# EAGLE schematic DESIGN7MP_Schematic (EAGLE 9.3.2)
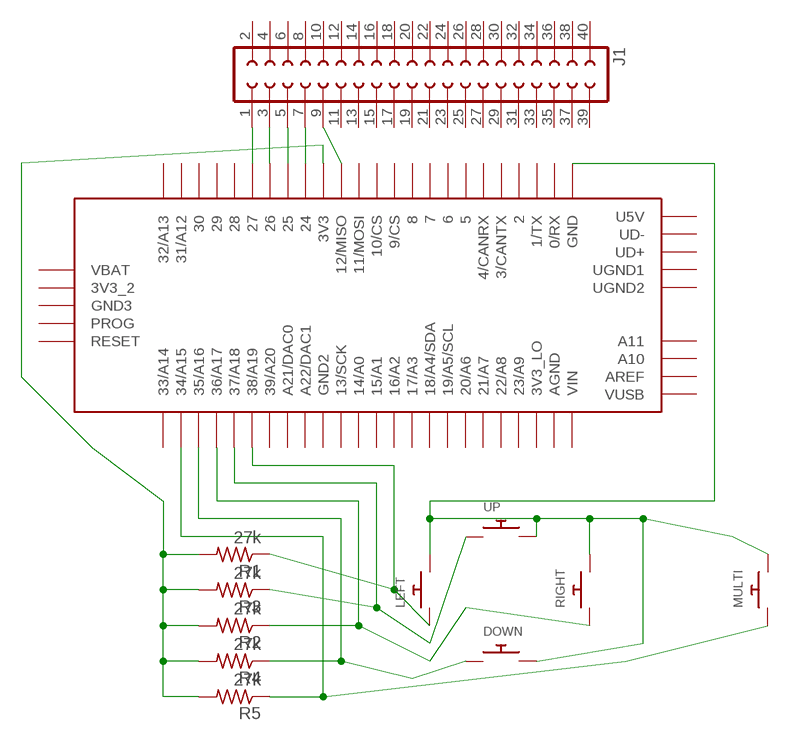
[diagram p0: schematic, sheet 1]

## Parts
DOWN  SWITCH_PUSHBUTTONEVQ-PE  [TACT_PANA-EVQ]
J1  SOCKET-40V  [S40V]
LEFT  SWITCH_PUSHBUTTONEVQ-PE  [TACT_PANA-EVQ]
MULTI  SWITCH_PUSHBUTTONEVQ-PE  [TACT_PANA-EVQ]
R1  27k  R-US_0204/5  [0204/5]
R2  27k  R-US_0204/5  [0204/5]
R3  27k  R-US_0204/5  [0204/5]
R4  27k  R-US_0204/5  [0204/5]
R5  27k  R-US_0204/5  [0204/5]
RIGHT  SWITCH_PUSHBUTTONEVQ-PE  [TACT_PANA-EVQ]
U$1  TEENSY_3.5/3.6  [TEENSY_3.5/3.6]
UP  SWITCH_PUSHBUTTONEVQ-PE  [TACT_PANA-EVQ]

## Nets
N$1: R1.2 R2.2 R3.2 R4.2 R5.2 U$1.3V3
N$2: MULTI.P$1 R5.1 U$1.34/A15
N$3: DOWN.P$1 R4.1 U$1.35/A16
N$4: R2.1 RIGHT.P$1 U$1.36/A17
N$5: R3.1 U$1.37/A18 UP.P$1
N$6: LEFT.P$1 R1.1 U$1.38/A19
N$7: DOWN.P$2 LEFT.P$2 MULTI.P$2 RIGHT.P$2 U$1.GND UP.P$2
N$8: J1.9 U$1.12/MISO
N$9: J1.7 U$1.24
N$10: J1.5 U$1.25
N$11: J1.3 U$1.26
N$12: J1.1 U$1.27
Unconnected: J1.2 J1.4 J1.6 J1.8 J1.10 J1.11 J1.12 J1.13 J1.14 J1.15 J1.16 J1.17 J1.18 J1.19 J1.20 J1.21 J1.22 J1.23 J1.24 J1.25 J1.26 J1.27 J1.28 J1.29 J1.30 J1.31 J1.32 J1.33 J1.34 J1.35 J1.36 J1.37 J1.38 J1.39 J1.40 U$1.0/RX U$1.1/TX U$1.2 U$1.3/CANTX U$1.3V3_2 U$1.3V3_LO U$1.4/CANRX U$1.5 U$1.6 U$1.7 U$1.8 U$1.9/CS U$1.10/CS U$1.11/MOSI U$1.13/SCK U$1.14/A0 U$1.15/A1 U$1.16/A2 U$1.17/A3 U$1.18/A4/SDA U$1.19/A5/SCL U$1.20/A6 U$1.21/A7 U$1.21/DAC0(A21/DAC0) U$1.22/A8 U$1.23/A9 U$1.28 U$1.29 U$1.30 U$1.31/A12 U$1.32/A13 U$1.33/A14 U$1.39/A20 U$1.A10 U$1.A11 U$1.A22/DAC1 U$1.AGND U$1.AREF U$1.GND2 U$1.GND3 U$1.PROG U$1.RESET U$1.U5V U$1.UD+ U$1.UD- U$1.UGND1 U$1.UGND2 U$1.VBAT U$1.VIN U$1.VUSB

## Library data of the parts
DOWN LEFT MULTI RIGHT UP = adafruit:SWITCH_PUSHBUTTON: Buttons SOFTTOUCHSMD_SJ - Soft touch temporary push button (Super Junk Akihabara) Compatible with SKPMANE010 [Mouser: 688-SKPMAN] C&K_KSS = Digikey: KSS221GLFS
J1 = con-3m-skt-header:SOCKET-40: 40 pin PCB Socket (3m 85xx/51xx)
R1-R5 = adafruit:R-US_: RESISTOR, American symbol
U$1 = Teensy356:TEENSY_3.5/3.6